# EAGLE design Becca Sap Flow Power Board v1_3 (EAGLE 9.6.2)
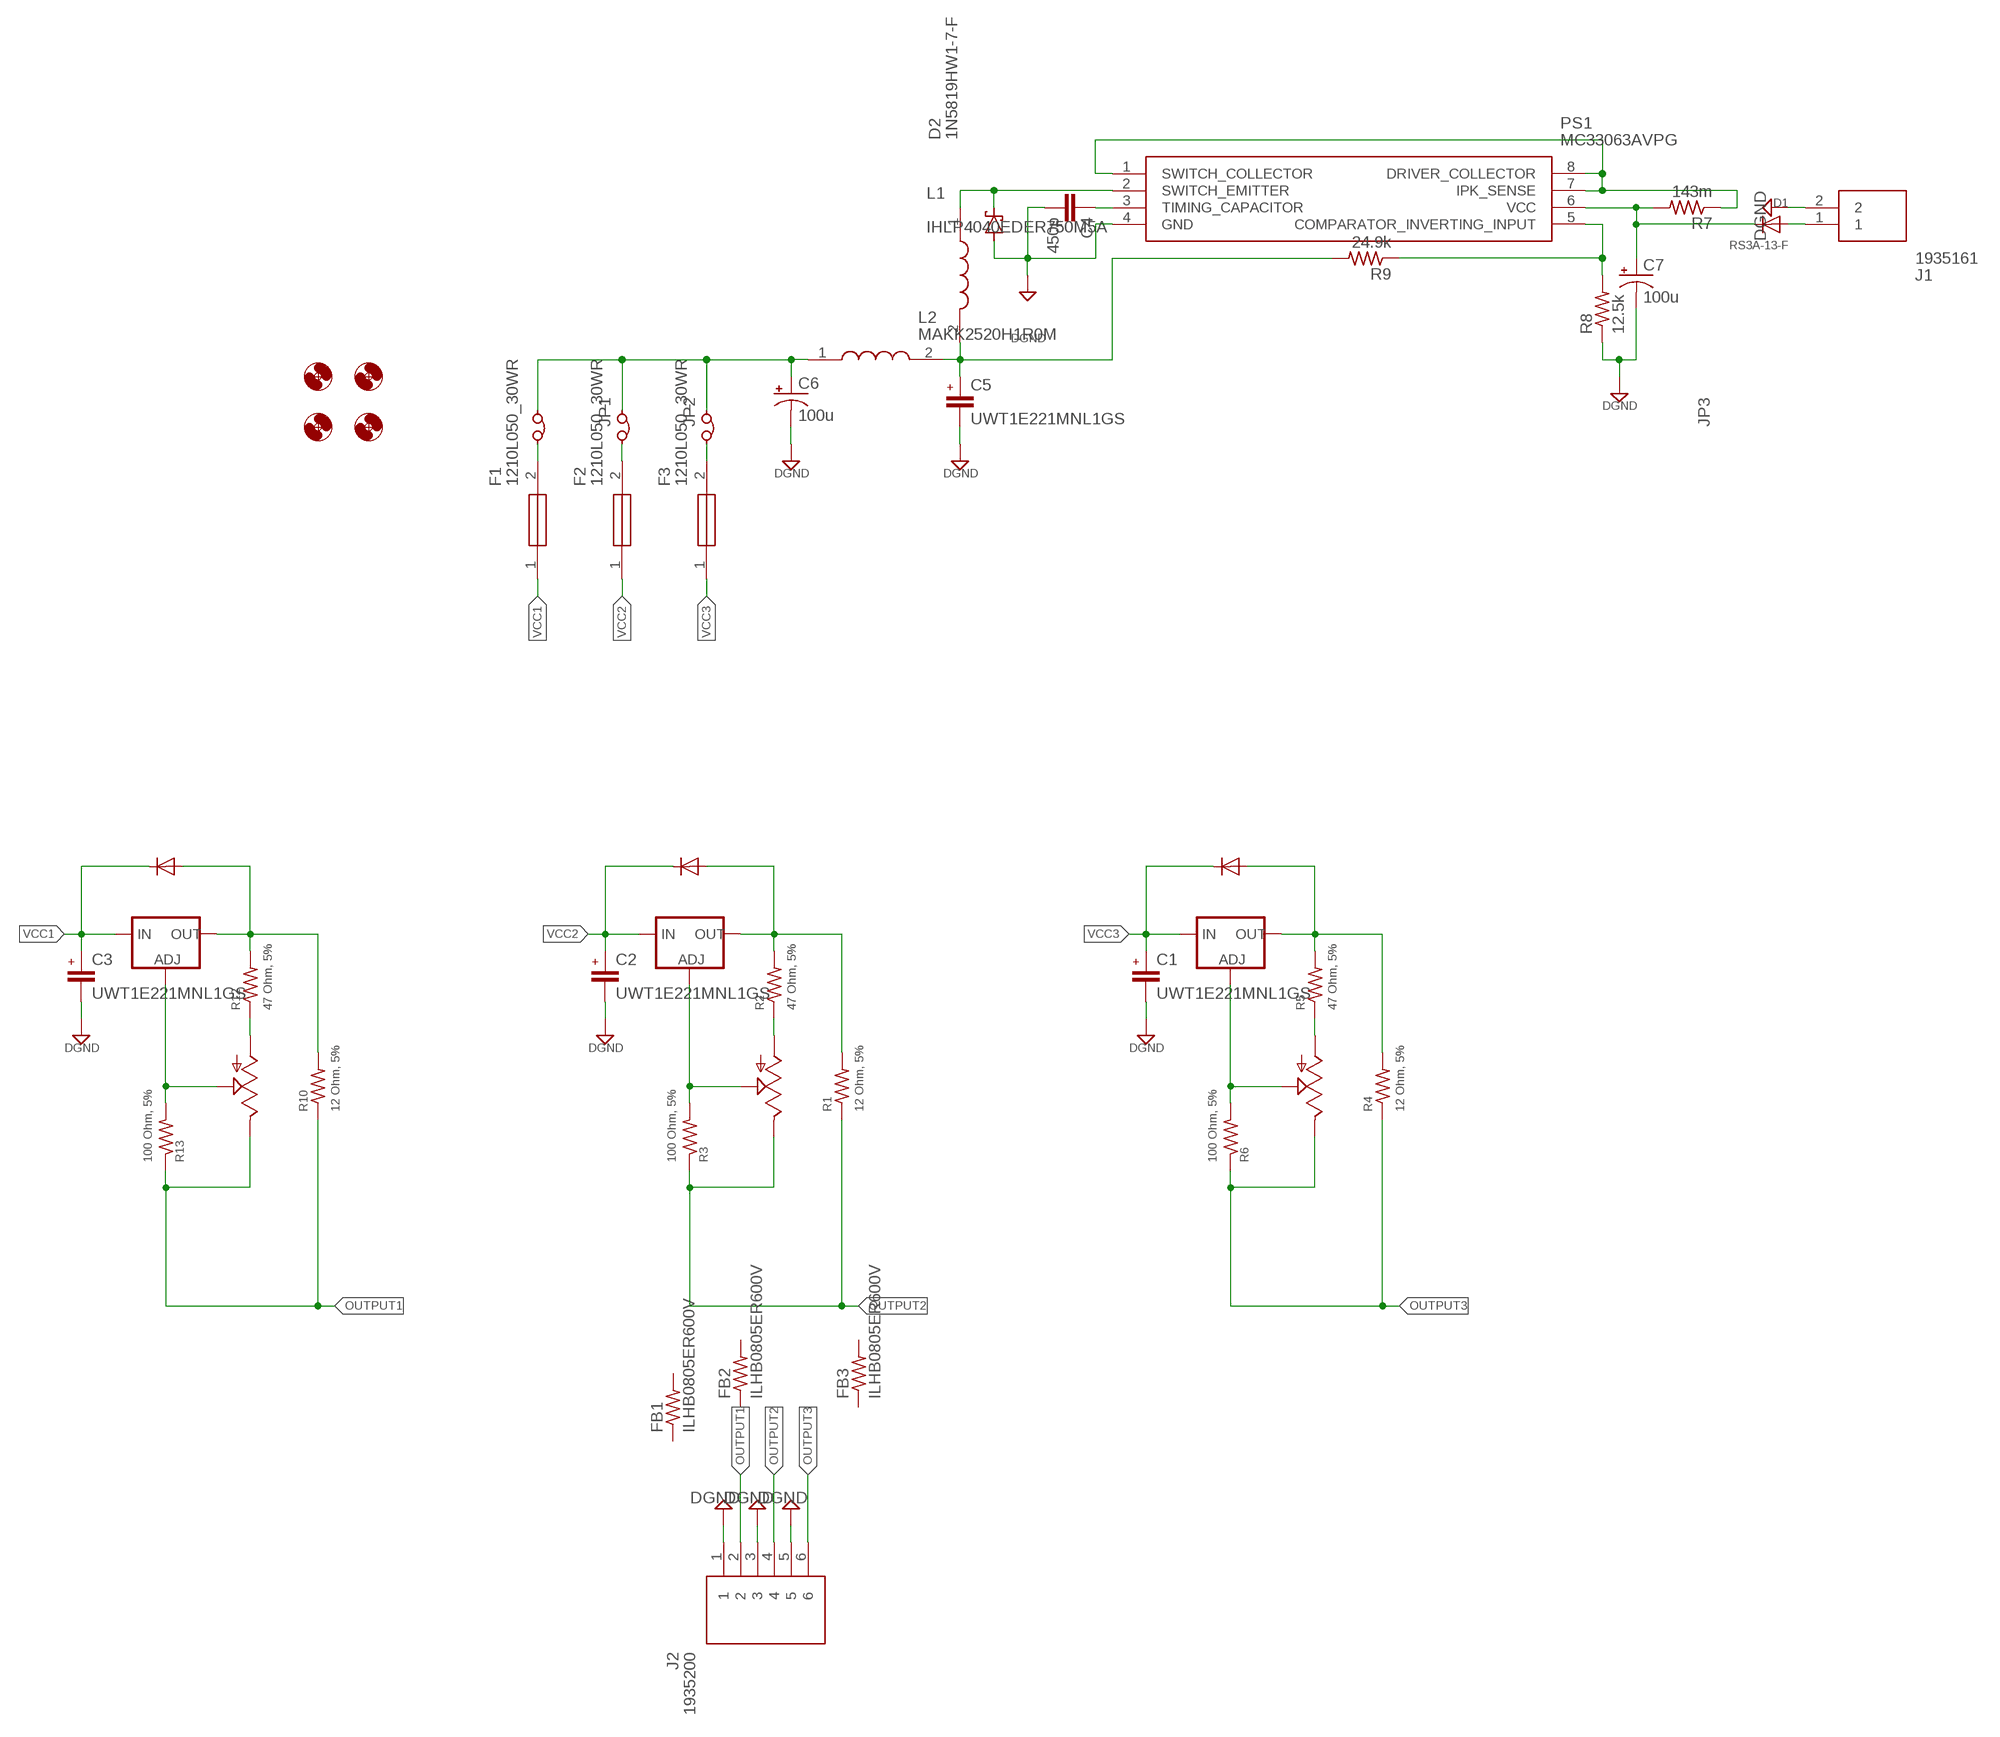
[diagram p0: schematic, sheet 1]

## Parts
C1  UWT1E221MNL1GS  [CAPAE830X1080N]
C2  UWT1E221MNL1GS  [CAPAE830X1080N]
C3  UWT1E221MNL1GS  [CAPAE830X1080N]
C4  450p  C-EUC0603  [C0603]
C5  UWT1E221MNL1GS  [CAPAE830X1080N]
C6  100u  CPOL-USE2.5-6  [E2,5-6]
C7  100u  CPOL-USE2.5-6  [E2,5-6]
D1  RS3A-13-F  [DIOM7959X250N]
D2  1N5819HW1-7-F  [SODFL3518X115N]
D3  S1A  [DIOM5027X250N]
D4  S1A  [DIOM5027X250N]
D6  S1A  [DIOM5027X250N]
F1  1210L050_30WR  [THRMC3226X125N]
F2  1210L050_30WR  [THRMC3226X125N]
F3  1210L050_30WR  [THRMC3226X125N]
FB1  ILHB0805ER600V  [BEADC2012X110N]
FB2  ILHB0805ER600V  [BEADC2012X110N]
FB3  ILHB0805ER600V  [BEADC2012X110N]
J1  1935161  [1935161]
J2  1935200  [1935200]
JP1  JUMPER  [HDR2X1]
JP2  JUMPER  [HDR2X1]
JP3  JUMPER  [HDR2X1]
L1  IHLP4040EDER750M5A  [INDPM115103X540N]
L2  MAKK2520H1R0M  [MAKK2520H1R0M]
PS1  MC33063AVPG  [DIP794W56P254L959H533Q8N]
R1  12 Ohm, 5%  R-US_R1210  [R1210]
R2  47 Ohm, 5%  R-US_R1210  [R1210]
R3  100 Ohm, 5%  R-US_R1210  [R1210]
R4  12 Ohm, 5%  R-US_R1210  [R1210]
R5  47 Ohm, 5%  R-US_R1210  [R1210]
R6  100 Ohm, 5%  R-US_R1210  [R1210]
R7  143m  R-US_R0603  [R0603]
R8  12.5k  R-US_R0603  [R0603]
R9  24.9k  R-US_R0603  [R0603]
R10  12 Ohm, 5%  R-US_R1210  [R1210]
R12  47 Ohm, 5%  R-US_R1210  [R1210]
R13  100 Ohm, 5%  R-US_R1210  [R1210]
U1  LM317MBSTT3G  [SOT230P700X175-4N]
U2  LM317MBSTT3G  [SOT230P700X175-4N]
U3  LM317MBSTT3G  [SOT230P700X175-4N]
U$1  MOUNT-HOLE3.0  [3,0]
U$2  MOUNT-HOLE3.0  [3,0]
U$3  MOUNT-HOLE3.0  [3,0]
U$4  MOUNT-HOLE3.0  [3,0]
VR1  3296W-1-102RLF  [3296W1102RLF]
VR2  3296W-1-102RLF  [3296W1102RLF]
VR3  3296W-1-102RLF  [3296W1102RLF]

## Nets
DGND: C1.2 C2.2 C3.2 C4.2 C5.2 C6.- C7.- D2.2(A) J1.2 J2.1 J2.3 J2.5 PS1.4(GND) R8.1
N$1: C6.+ JP1.1 JP2.1 JP3.1 L2.1
N$2: D3.2(A) R1.2 R2.2 U2.2(OUT)
N$3: F1.2 JP3.2
N$4: F2.2 JP1.2
N$5: D1.2(A) J1.1
N$6: PS1.1(SWITCH_COLLECTOR) PS1.7(IPK_SENSE) PS1.8(DRIVER_COLLECTOR) R7.1
N$7: R3.2 U2.1(ADJ) VR2.2(S)
N$8: F3.2 JP2.2
N$9: C7.+ D1.1(K) PS1.6(VCC) R7.2
N$10: R2.1 VR2.1(A)
N$11: D4.2(A) R4.2 R5.2 U3.2(OUT)
N$12: D6.2(A) R10.2 R12.2 U1.2(OUT)
N$13: R6.2 U3.1(ADJ) VR3.2(S)
N$14: R13.2 U1.1(ADJ) VR1.2(S)
N$15: R12.1 VR1.1(A)
N$16: R5.1 VR3.1(A)
N$17: C4.1 PS1.3(TIMING_CAPACITOR)
N$18: PS1.5(COMPARATOR_INVERTING_INPUT) R8.2 R9.1
N$19: D2.1(C) L1.1 PS1.2(SWITCH_EMITTER)
N$20: C5.1 L1.2 L2.2 R9.2
OUTPUT1: J2.2 R10.1 R13.1 VR1.3(E)
OUTPUT2: J2.4 R1.1 R3.1 VR2.3(E)
OUTPUT3: J2.6 R4.1 R6.1 VR3.3(E)
VCC1: C3.1 D6.1(K) F1.1 U1.3(IN)
VCC2: C2.1 D3.1(K) F2.1 U2.3(IN)
VCC3: C1.1 D4.1(K) F3.1 U3.3(IN)
Unconnected: FB1.1 FB1.2 FB2.1 FB2.2 FB3.1 FB3.2

## Library data of the parts
C1-C3 C5 = Becca-Sap-Flow-LORA:UWT1E221MNL1GS: NICHICON - UWT1E221MNL1GS - ALUMINUM ELECTROLYTIC CAPACITOR 220UF 25V 20%, SMD Source: Datasheet <http://www.nichicon.co.jp/english/products/pdfs/e-uwt.pdf>; DESCRIPTION: NICHICON - UWT1E221MNL1GS - ALUMINUM ELECTROLYTIC CAPACITOR 220UF 25V 20%, SMD; HEIGHT: 10.8mm; MANUFACTURER_NAME: Nichicon; MANUFACTURER_PART_NUMBER: UWT1E221MNL1GS; MOUSER_PART_NUMBER: 647-UWT1E221MNL1GS; MOUSER_PRICE-STOCK: https://www.mouser.co.uk/ProductDetail/Nichicon/UWT1E221MNL1GS?qs=9nXXK2icEIxMJgFBHlqiZQ%3D%3D
C4 = rcl:C-EU: CAPACITOR, European symbol; SPICEPREFIX: C
C6 C7 = rcl:CPOL-US: POLARIZED CAPACITOR, American symbol; SPICEPREFIX: C
D1 = Becca-Sap-Flow-LORA:RS3A-13-F: DIODE GEN PURP 50V 3A SMC Source: Datasheet <https://componentsearchengine.com/Datasheets/1/RS3A-13-F.pdf>; DESCRIPTION: DIODE GEN PURP 50V 3A SMC; HEIGHT: 2.5mm; MANUFACTURER_NAME: Diodes Incorporated; MANUFACTURER_PART_NUMBER: RS3A-13-F; MOUSER_PART_NUMBER: 621-RS3A-13-F; MOUSER_PRICE-STOCK: https://www.mouser.com/Search/Refine.aspx?Keyword=621-RS3A-13-F
D2 = Becca-Sap-Flow-LORA:1N5819HW1-7-F: 1N5819 Schottky Diode 40V 1A SOD123F Source: Datasheet <https://www.diodes.com//assets/Datasheets/1N5819HW1.pdf>; DESCRIPTION: 1N5819 Schottky Diode 40V 1A SOD123F; HEIGHT: 1.15mm; MANUFACTURER_NAME: Diodes Incorporated; MANUFACTURER_PART_NUMBER: 1N5819HW1-7-F; MOUSER_PART_NUMBER: 621-1N5819HW1-7-F; MOUSER_PRICE-STOCK: https://www.mouser.co.uk/ProductDetail/Diodes-Incorporated/1N5819HW1-7-F?qs=60RJRzIpcl9ACQG7Zn63jQ%3D%3D
D3 D4 D6 = Becca-Sap-Flow-LORA:S1A: Rectifier Diode Switching 50V 1A 1500ns 2-Pin SMA T/R Source: Datasheet <https://diotec.com/request/datasheet/s1a.pdf>; DESCRIPTION: Rectifier Diode Switching 50V 1A 1500ns 2-Pin SMA T/R; HEIGHT: 2.5mm; MANUFACTURER_NAME: Diotec; MANUFACTURER_PART_NUMBER: S1A; MOUSER_PART_NUMBER: 637-S1A; MOUSER_PRICE-STOCK: https://www.mouser.co.uk/ProductDetail/Diotec-Semiconductor/S1A?qs=OlC7AqGiEDlqVjQP70PTqA%3D%3D
F1-F3 = Becca-Sap-Flow-LORA:1210L050_30WR: Resettable Fuses - PPTC PTC 30V POLYFUSE SURF MOUNT 1210 0.5A Source: Datasheet <https://componentsearchengine.com/Datasheets/1/1210L050_30WR.pdf>; DESCRIPTION: Resettable Fuses - PPTC PTC 30V POLYFUSE SURF MOUNT 1210 0.5A; HEIGHT: 1.25mm; MANUFACTURER_NAME: LITTELFUSE; MANUFACTURER_PART_NUMBER: 1210L050/30WR; MOUSER_PART_NUMBER: 576-1210L050/30WR; MOUSER_PRICE-STOCK: https://www.mouser.co.uk/ProductDetail/Littelfuse/1210L050-30WR?qs=lM4gFlnEeEOvFoAkPA9Mhg%3D%3D
FB1-FB3 = Becca-Sap-Flow-LORA:ILHB0805ER600V: Ferrite Beads Multi-Layer High Current 60Ohm 25% 100MHz 3A 30mOhm DCR 0805 T/R Source: Datasheet <https://www.arrow.com/en/products/ilhb0805er600v/vishay>; DESCRIPTION: Ferrite Beads Multi-Layer High Current 60Ohm 25% 100MHz 3A 30mOhm DCR 0805 T/R; HEIGHT: 1.1mm; MANUFACTURER_NAME: Vishay; MANUFACTURER_PART_NUMBER: ILHB0805ER600V; MOUSER_PART_NUMBER: 70-ILHB0805ER600V; MOUSER_PRICE-STOCK: https://www.mouser.co.uk/ProductDetail/Vishay-Dale/ILHB0805ER600V?qs=nDC8RkArV2CRAw2z9yWdfQ%3D%3D
J1 = Becca-Sap-Flow-LORA:1935161: Phoenix Contact COMBICON PT PCB Terminal Block, 2 Way/Pole, Screw Terminals, 26 14 AWG Through Hole, Nylon Source: Datasheet <https://datasheet.datasheetarchive.com/originals/distributors/SFDatasheet-2/sf-00057459.pdf>; DESCRIPTION: Phoenix Contact COMBICON PT PCB Terminal Block, 2 Way/Pole, Screw Terminals, 26 14 AWG Through Hole, Nylon; HEIGHT: 11.55mm; MANUFACTURER_NAME: Phoenix Contact; MANUFACTURER_PART_NUMBER: 1935161; MOUSER_PART_NUMBER: 651-1935161; MOUSER_PRICE-STOCK: https://www.mouser.co.uk/ProductDetail/Phoenix-Contact/1935161?qs=W3wJikR1%252BS6eKzfFl8Rbew%3D%3D
J2 = Becca-Sap-Flow-LORA:1935200: Fixed Terminal Blocks PT 1.5/6-5.0-H Source: Datasheet <https://datasheet.datasheetarchive.com/originals/distributors/SFDatasheet-2/sf-00057463.pdf>; DESCRIPTION: Fixed Terminal Blocks PT 1.5/6-5.0-H; HEIGHT: 11.55mm; MANUFACTURER_NAME: Phoenix Contact; MANUFACTURER_PART_NUMBER: 1935200; MOUSER_PART_NUMBER: 651-1935200; MOUSER_PRICE-STOCK: https://www.mouser.co.uk/ProductDetail/Phoenix-Contact/1935200?qs=8BCRtFWWXOTOyOTMiNRITA%3D%3D
JP1-JP3 = Becca-Sap-Flow-LORA:JUMPER: Wire jumper .1" C
L1 = Becca-Sap-Flow-LORA:IHLP4040EDER750M5A: Fixed Inductors 75uH 20% High Temp AEC-Q200 Source: Datasheet <https://www.vishay.com/docs/34499/ihlp4040ed5a.pdf>; DESCRIPTION: Fixed Inductors 75uH 20% High Temp AEC-Q200; HEIGHT: 5.4mm; MANUFACTURER_NAME: Vishay; MANUFACTURER_PART_NUMBER: IHLP4040EDER750M5A; MOUSER_PART_NUMBER: 70-IHLP4040EDR750M5A; MOUSER_PRICE-STOCK: https://www.mouser.co.uk/ProductDetail/Vishay-Dale/IHLP4040EDER750M5A?qs=l7cgNqFNU1jPqWkBgPPMpg%3D%3D
L2 = Becca-Sap-Flow-LORA:MAKK2520H1R0M: 1 H Shielded Drum Core, Wirewound Inductor 3 A 53mOhm Max 1008 (2520 Metric) Source: Datasheet <https://componentsearchengine.com/Datasheets/1/MAKK2520H1R0M.pdf>; DESCRIPTION: 1 H Shielded Drum Core, Wirewound Inductor 3 A 53mOhm Max 1008 (2520 Metric); HEIGHT: 1mm; MANUFACTURER_NAME: TAIYO YUDEN; MANUFACTURER_PART_NUMBER: MAKK2520H1R0M; MOUSER_PART_NUMBER: 963-MAKK2520H1R0M; MOUSER_PRICE-STOCK: https://www.mouser.com/Search/Refine.aspx?Keyword=963-MAKK2520H1R0M
PS1 = Becca-Sap-Flow-LORA:MC33063AVPG: Low Standby Current; Output Voltage Adjustable; Precision 2% Reference; Operation from 3.0 V to 40 V Input; Current Limiting; Frequency Operation to 100 kHz; Output Switch Current to 1.5 A; MC34063A = 0 to +70degC; MC33063A = -40 to +85degC; MC33063AV / NCV33063A = -40 to +125degC; 4x4mm DFN package option Source: Datasheet <https://www.onsemi.com/pub/Collateral/MC34063A-D.PDF>; DESCRIPTION: Low Standby Current; Output Voltage Adjustable; Precision 2% Reference; Operation from 3.0 V to 40 V Input; Current Limiting; Frequency Operation to 100 kHz; Output Switch Current to 1.5 A; MC34063A = 0 to +70degC; MC33063A = -40 to +85degC; MC33063AV / NCV33063A = -40 to +125degC; 4x4mm DFN package option; HEIGHT: 5.33mm; MANUFACTURER_NAME: onsemi; MANUFACTURER_PART_NUMBER: MC33063AVPG
R1-R6 R10 R12 R13 = Becca-Sap-Flow-LORA:R-US_: RESISTOR, American symbol; SPICEPREFIX: R
R7-R9 = rcl:R-US_: RESISTOR, American symbol; SPICEPREFIX: R
U1-U3 = Becca-Sap-Flow-LORA:LM317MBSTT3G: Internal Short Circuit Current Limiting; Internal Thermal Overload Protection; Output Current in Excess of 500 mA; Output Transistor Safe-Area Compensation; Output Adjustable between 1.2 V and 37 V; Floating Operation for High Voltage Applications; Eliminates Stocking Many Fixed Voltages; Pb-Free Packages are Available; NCV Prefix for Automotive and Other Applications Requiring Site Control Changes Source: Datasheet <https://www.onsemi.com/pub/Collateral/LM317M-D.PDF>; DESCRIPTION: Internal Short Circuit Current Limiting; Internal Thermal Overload Protection; Output Current in Excess of 500 mA; Output Transistor Safe-Area Compensation; Output Adjustable between 1.2 V and 37 V; Floating Operation for High Voltage Applications; Eliminates Stocking Many Fixed Voltages; Pb-Free Packages are Available; NCV Prefix for Automotive and Other Applications Requiring Site Control Changes; HEIGHT: 1.75mm; MANUFACTURER_NAME: onsemi; MANUFACTURER_PART_NUMBER: LM317MBSTT3G; MOUSER_PART_NUMBER: 863-LM317MBSTT3G; MOUSER_PRICE-STOCK: https://www.mouser.co.uk/ProductDetail/onsemi/LM317MBSTT3G?qs=2OtswVQKCOFxsFzIc5DGlw%3D%3D
U$1-U$4 = Becca-Sap-Flow-LORA:MOUNT-HOLE: MOUNTING HOLE with drill center marker
VR1-VR3 = Becca-Sap-Flow-LORA:3296W-1-102RLF: 1 kOhms 0.5W, 1/2W PC Pins Through Hole Trimmer Potentiometer Cermet 25.0 Turn Top Adjustment Source: Datasheet <https://www.bourns.com/docs/Product-Datasheets/3296.pdf>; DESCRIPTION: 1 kOhms 0.5W, 1/2W PC Pins Through Hole Trimmer Potentiometer Cermet 25.0 Turn Top Adjustment; HEIGHT: 11.8mm; MANUFACTURER_NAME: Bourns; MANUFACTURER_PART_NUMBER: 3296W-1-102RLF; MOUSER_PART_NUMBER: 652-3296W-1-102RLF; MOUSER_PRICE-STOCK: https://www.mouser.co.uk/ProductDetail/Bourns/3296W-1-102RLF?qs=oM%2FE6%2FUWOpR5bwX1MfrWeA%3D%3D

## Net classes
1 highpower: width 0.305 mm, drill 0.483 mm

## Board
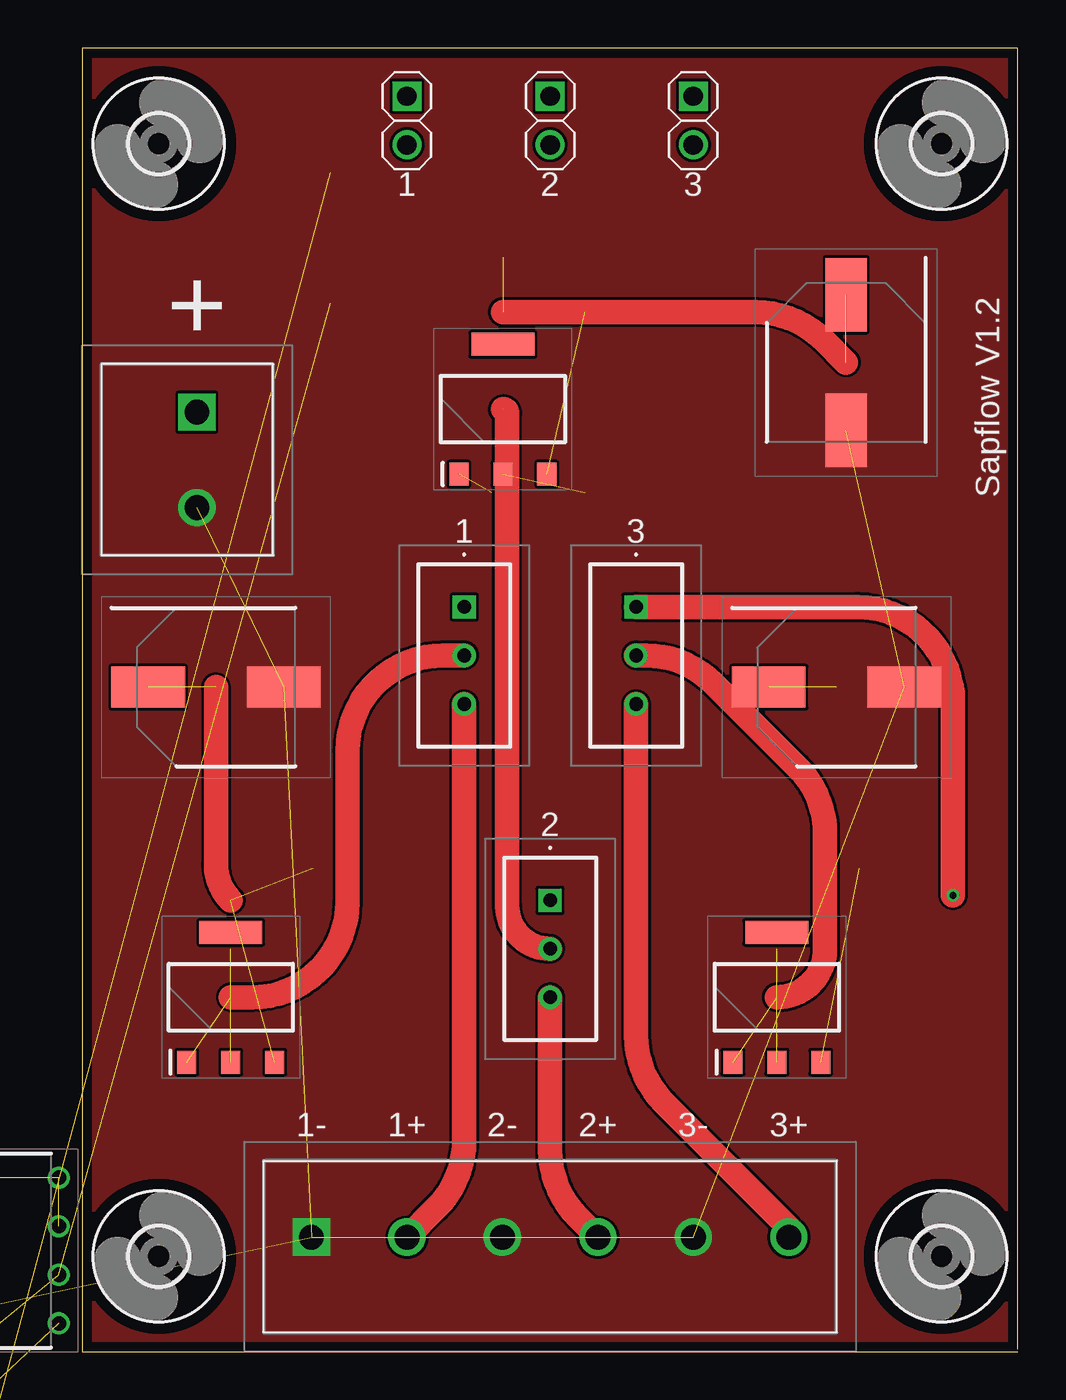
[diagram p1: board, top side]
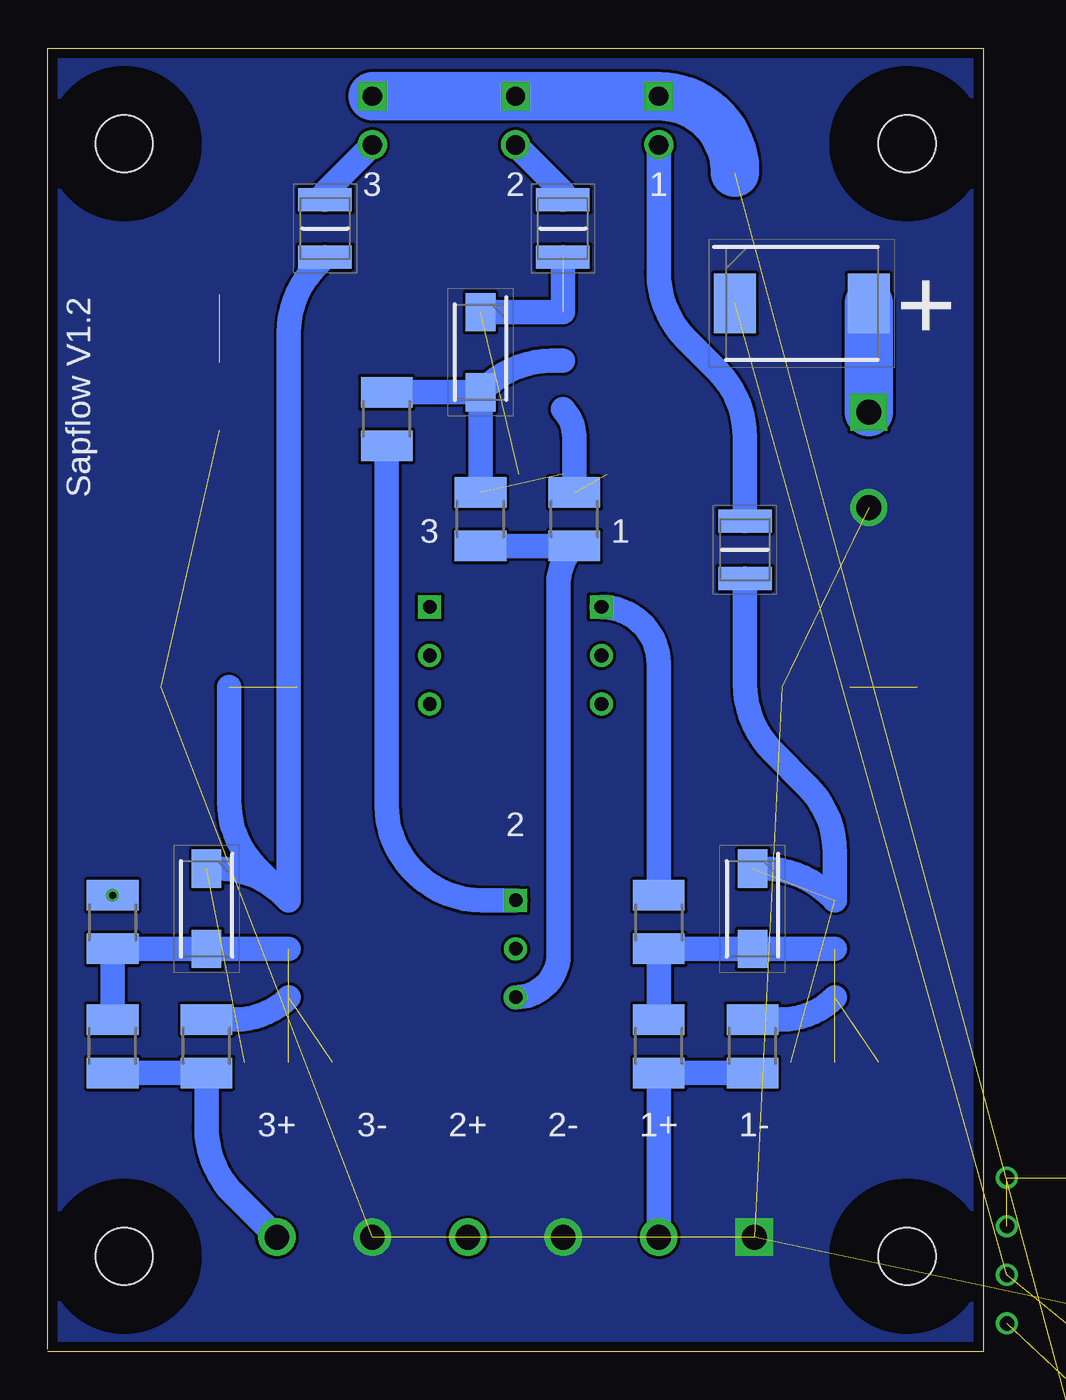
[diagram p2: board, bottom side, seen from below]

Size 49 x 68.26 mm. Coordinates in mm from the lower left corner, seen from the top.
Outline: 49,0 0,0 0,68.26 49,68.26 49,0.13
Copper layers (1*16): Top 0.035mm / dielectric 1.6mm / Bottom 0.035mm
Design rules "Elecrow_2-layer_PCB_eagle_rule": minimum track width 6mil, minimum drill 12mil, track to track 6mil, track to pad 6mil, pad to pad 6mil, via to via 8mil, smd to smd 0mil, copper to edge 20mil, drill to drill 10mil, minimum pad ring 6mil, minimum via ring 6mil, stop-mask expansion 0mil, vias tented up to drill 100mil, thermal gap 10mil

### Footprints (pad centres in the part's own frame; a part is rotated, then mirrored left to right if it is on the bottom)
CAPAE830X1080N = smd 3.85 x 2.15: 1 -3.55,0; 2 3.55,0
C0603 = smd 1.1 x 1: 1 -0.85,0; 2 0.85,0
E2,5-6 = drill 0.813 pad 1.6: + -1.27,0 | drill 0.813 pad 1.6 octagon: - 1.27,0
DIOM7959X250N = smd 2.2 x 3.1: 1 -3.5,0; 2 3.5,0
SODFL3518X115N = smd 1.12 x 1.37: 1 -1.5,0; 2 1.5,0
DIOM5027X250N = smd 2 x 1.55: 1 -2.1,0; 2 2.1,0
THRMC3226X125N = smd 1.2 x 2.8: 1 -1.5,0; 2 1.5,0
BEADC2012X110N = smd 1.2 x 1.45: 1 -0.85,0; 2 0.85,0
1935161 = drill 1.3 pad 1.95 square: 1 0,0 | drill 1.3 pad 1.95: 2 5,0
1935200 = drill 1.3 pad 1.95 square: 1 0,0 | drill 1.3 pad 1.95: 2 5,0; 3 10,0; 4 15,0; 5 20,0; 6 25,0
HDR2X1 = drill 1.016 square: 1 0,0 | drill 1.016: 2 2.54,0
INDPM115103X540N = smd 3.15 x 4.9: 1 -4.75,0; 2 4.75,0
MAKK2520H1R0M = smd 0.8 x 2: 1 -1,0; 2 1,0
DIP794W56P254L959H533Q8N = drill 0.76 pad 1.16 square: 1 -3.97,3.81 | drill 0.76 pad 1.16: 2 -3.97,1.27; 3 -3.97,-1.27; 4 -3.97,-3.81; 5 3.97,-3.81; 6 3.97,-1.27; 7 3.97,1.27; 8 3.97,3.81
R1210 = smd 1.6 x 2.7: 1 -1.4,0; 2 1.4,0
R0603 = smd 1 x 1.1: 1 -0.85,0; 2 0.85,0
SOT230P700X175-4N = smd 1.2 x 1: 1 -3.4,2.3; 2 -3.4,0; 3 -3.4,-2.3 | smd 1.2 x 3.3: 4 3.4,0
3,0 = hole 3: 0,0
3296W1102RLF = drill 0.71 pad 1.217 square: 1 0,0 | drill 0.71 pad 1.217: 2 0,2.54; 3 0,5.08

### Placement (x,y rotation side)
C1  39.5,34.8 0 top
C2  40,51.8 270 top
C3  7,34.8 0 top
C4  -10.2,-13.1 0 top  (outside the outline)
C5  -31.1,-51.2 0 top  (outside the outline)
C6  -8.8,-23.8 0 top  (outside the outline)
C7  -8.8,-30.1 0 top  (outside the outline)
D1  9.5,54.9 0 bottom
D2  -8,-34.2 0 top  (outside the outline)
D3  26.34,52.34 270 bottom
D4  40.69,23.2 270 bottom
D6  12.09,23.2 270 bottom
F1  12.49,42 90 bottom
F2  22.03,58.82 90 bottom
F3  34.47,58.82 90 bottom
FB1  -20.6,-40.7 0 top  (outside the outline)
FB2  -24.9,-43 0 top  (outside the outline)
FB3  -29.2,-45.3 0 top  (outside the outline)
J1  6,49.21 270 top
J2  12,6 0 top
JP1  24.5,65.75 270 top
JP2  32,65.75 270 top
JP3  17,65.75 270 top
L1  -20.3,-30.3 0 top  (outside the outline)
L2  -20.6,-37.4 0 top  (outside the outline)
PS1  -5.2,5.3 0 top
R1  26.34,43.6 90 bottom
R2  31.25,48.84 90 bottom
R3  21.42,43.6 90 bottom
R4  45.6,16 90 bottom
R5  45.6,22.5 270 bottom
R6  40.69,16 90 bottom
R7  -10.2,-2.6 0 top  (outside the outline)
R8  -10.2,-6.1 0 top  (outside the outline)
R9  -10.2,-9.6 0 top  (outside the outline)
R10  17,16 90 bottom
R12  17,22.5 270 bottom
R13  12.09,16 90 bottom
U1  7.78,18.56 90 top
U2  22.03,49.36 90 top
U3  36.38,18.56 90 top
U$1  45,5 0 top
U$2  45,63.26 0 top
U$3  4,5 0 top
U$4  4,63.26 0 top
VR1  20,39 180 top
VR2  24.5,23.64 180 top
VR3  29,39 180 top

### Tracks (layer width: path | path; a pad name or v marks a point on that pad's centre or on a via)
DGND  (13 unrouted)
  pour Top (rank 3, no thermals): 0,0 49,0 49,68.26 0,68.26
  pour Bottom (rank 3, no thermals): 0,0 49,0 49,68.26 0,68.26
N$1  (2 unrouted)
  Bottom 2.54: JP2.1 JP1.1 JP3.1 arc90 13,61.74
N$2  (1 unrouted)
  Bottom 1.27: 22.02,51.9 22.61,51.9 arc-45 26.14,50.44 D3.2 | D3.2 R1.2 | D3.2 R2.2
N$3
  Bottom 1.27: JP3.2 17,56.52 arc-45 15.54,52.99 13.95,51.4 arc45 12.49,47.87 F1.2
N$4
  Bottom 1.27: F2.2 22.02,60.73 JP1.2
N$5
  Bottom 2.54: D1.2 J1.1
N$6  (3 unrouted)
N$7  (2 unrouted)
  Top 1.27: VR2.2 arc-90 22.25,23.35 22.25,49.13 arc90 22.02,49.36
  Bottom 1.27: 22.02,49.36 arc45 21.42,47.9 R3.2
N$8
  Bottom 1.27: JP2.2 34.48,60.73 F3.2
N$9  (3 unrouted)
N$10
  Bottom 1.27: R2.1 31.25,28.64 arc-90 26.25,23.64 VR2.1
N$11  (1 unrouted)
  Bottom 1.27: 36.38,21.1 D4.2 R5.2 R4.2
N$12  (1 unrouted)
  Bottom 1.27: 7.78,21.1 D6.2 R12.2 R10.2
N$13  (2 unrouted)
  Top 1.27: VR3.2 29.53,36.46 arc-45 33.06,35 37.44,30.62 arc-45 38.9,27.09 38.9,21.09 arc-90 36.38,18.56
  Bottom 1.27: 36.38,18.56 arc45 39.18,17.4 R6.2
N$14  (2 unrouted)
  Top 1.27: VR1.2 18.89,36.46 arc90 13.89,31.46 13.89,23.56 arc-90 8.89,18.56 7.78,18.56
  Bottom 1.27: 7.78,18.56 arc45 10.58,17.4 R13.2
N$15
  Bottom 1.27: R12.1 17,36 arc-90 VR1.1
N$16  (via drill 0.35)
  Top 1.27: VR3.1 40.6,39 arc-90 45.6,34 R5.1
  other vias: 45.6,23.9
N$17  (1 unrouted)
N$18  (2 unrouted)
N$19  (2 unrouted)
N$20  (3 unrouted)
OUTPUT1
  Top 1.27: VR1.3 20,11.07 arc-45 18.54,7.54 J2.2
  Bottom 1.27: R13.1 R10.1 J2.2
OUTPUT2
  Top 1.27: VR2.3 24.5,10.57 arc45 25.96,7.04 J2.4
  Bottom 1.27: R1.1 R3.1 arc-45 22.25,40.2 22.25,20.81 arc90 VR2.3
OUTPUT3
  Top 1.27: VR3.3 29,16.57 arc45 30.46,13.04 37,6.5 J2.6
  Bottom 1.27: R4.1 R6.1 40.69,11.76 arc-45 39.22,8.22 J2.6
VCC1  (3 unrouted)
  Top 1.27: 7,34.8 7,25.51 arc45 7.78,23.64
  Bottom 1.27: D6.1 11.51,25.3 arc45 7.97,23.84 7.78,23.64 7.78,26.1 arc-45 9.24,29.64 11.02,31.42 arc45 12.49,34.96 F1.1
VCC2  (3 unrouted)
  Top 1.27: 40,51.8 38.82,52.98 arc45 35.29,54.44 22.02,54.44
  Bottom 1.27: F2.1 22.02,54.44 D3.1
VCC3  (2 unrouted)
  Bottom 1.27: 36.38,23.64 36.57,23.84 arc-45 40.11,25.3 D4.1 | 39.5,34.8 39.5,28.84 arc-45 38.04,25.3 36.38,23.64 | F3.1 34.91,56.89 arc-45 36.38,53.35 36.38,23.64

### Text on the board
tPlace: 1 | 2 | 3 | + | Sapflow V1.2 | 1 | 3 | 2 | 1- | 1+ | 2- | 2+ | 3- | 3+
bPlace: 1 | 2 | 3 | + | Sapflow V1.2 | 1 | 3 | 2 | 1- | 1+ | 2- | 2+ | 3- | 3+